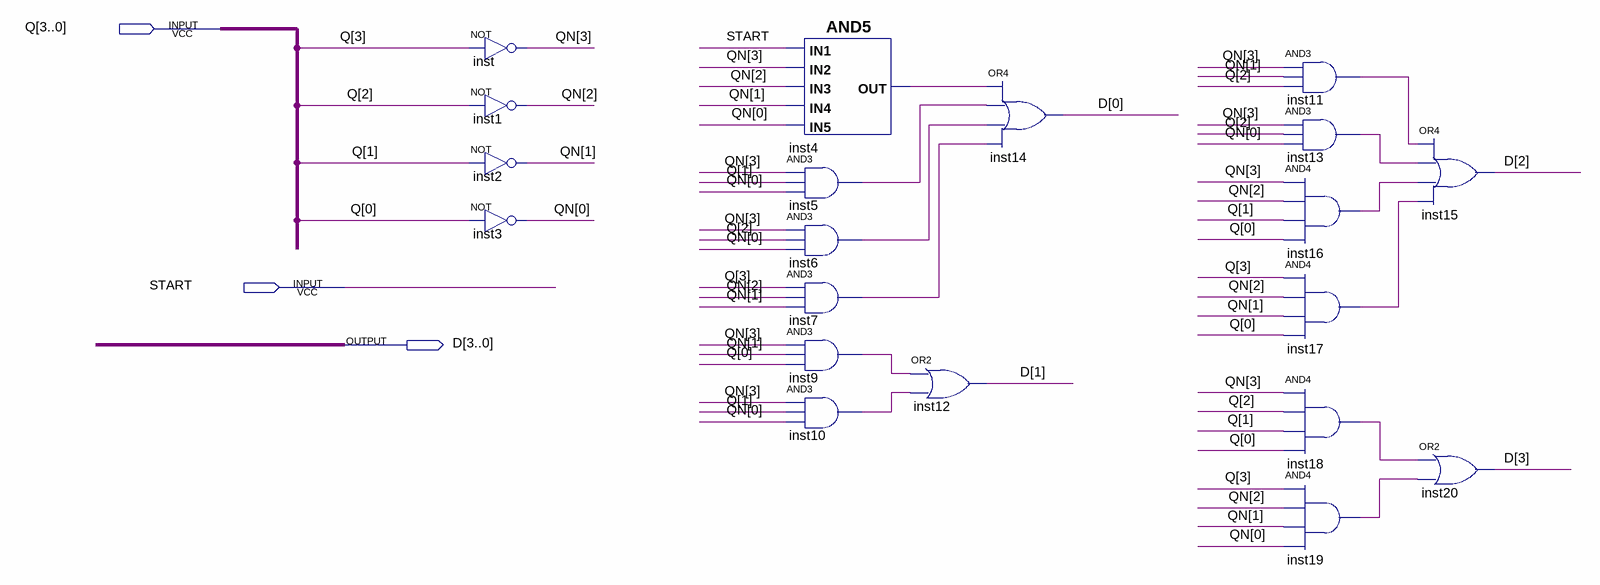
[diagram p0: schematic sheet]
// Quartus schematic NEXTSTATE.bdf as structural Verilog: 20 symbols, 3 pins
module NEXTSTATE (
  input  [3:0] Q,
  input  START,
  output [3:0] D
);

  wire inst4_out, inst5_out, inst6_out, inst7_out, inst9_out, inst10_out, inst11_out, inst13_out, inst16_out,
       inst17_out, inst18_out, inst19_out;
  wire [3:0] QN;

  not inst (QN[3], Q[3]);
  not inst1 (QN[2], Q[2]);
  not inst2 (QN[1], Q[1]);
  not inst3 (QN[0], Q[0]);
  and inst4 (inst4_out, START, QN[3], QN[2], QN[1], QN[0]);
  and inst5 (inst5_out, QN[3], Q[1], QN[0]);
  and inst6 (inst6_out, QN[3], Q[2], QN[0]);
  and inst7 (inst7_out, Q[3], QN[2], QN[1]);
  and inst9 (inst9_out, QN[3], QN[1], Q[0]);
  and inst10 (inst10_out, QN[3], Q[1], QN[0]);
  or inst12 (D[1], inst9_out, inst10_out);
  or inst14 (D[0], inst4_out, inst5_out, inst6_out, inst7_out);
  and inst11 (inst11_out, QN[3], QN[1], Q[2]);
  and inst13 (inst13_out, QN[3], Q[2], QN[0]);
  and inst16 (inst16_out, QN[3], QN[2], Q[1], Q[0]);
  and inst17 (inst17_out, Q[3], QN[2], QN[1], Q[0]);
  and inst18 (inst18_out, QN[3], Q[2], Q[1], Q[0]);
  and inst19 (inst19_out, Q[3], QN[2], QN[1], QN[0]);
  or inst15 (D[2], inst11_out, inst13_out, inst16_out, inst17_out);
  or inst20 (D[3], inst18_out, inst19_out);
endmodule
